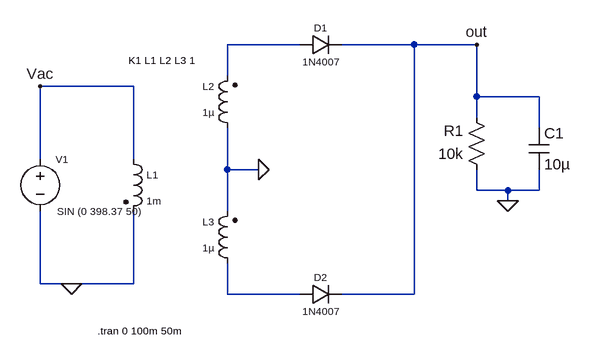
[diagram p0: schematic center-tapped-without-capacitor.asc]
center-tapped-without-capacitor.asc, the LTspice schematic file:
Version 4.1
SHEET 1 888 680
WIRE 464 -48 352 -48
WIRE 640 -48 528 -48
WIRE 736 -48 640 -48
WIRE 352 0 352 -48
WIRE 208 16 64 16
WIRE 736 32 736 -48
WIRE 832 32 736 32
WIRE 736 64 736 32
WIRE 832 80 832 32
WIRE 64 128 64 16
WIRE 208 128 208 16
WIRE 352 144 352 80
WIRE 400 144 352 144
WIRE 736 176 736 144
WIRE 784 176 736 176
WIRE 832 176 832 144
WIRE 832 176 784 176
WIRE 784 192 784 176
WIRE 352 208 352 144
WIRE 64 320 64 208
WIRE 112 320 64 320
WIRE 208 320 208 208
WIRE 208 320 112 320
WIRE 352 336 352 288
WIRE 464 336 352 336
WIRE 640 336 640 -48
WIRE 640 336 528 336
FLAG 112 320 0
FLAG 400 144 0
FLAG 64 16 Vac
FLAG 736 -48 out
FLAG 784 192 0
SYMBOL voltage 64 112 R0
WINDOW 0 24 16 Left 1
WINDOW 3 90 96 Center 1
SYMATTR InstName V1
SYMATTR Value SIN (0 398.37 50)
SYMBOL ind2 192 112 R0
WINDOW 0 36 40 Left 1
WINDOW 3 36 80 Left 1
SYMATTR InstName L1
SYMATTR Value 1m
SYMATTR SpiceLine Rser=1m
SYMBOL ind2 368 96 R180
WINDOW 0 36 80 Left 1
WINDOW 3 36 40 Left 1
SYMATTR InstName L2
SYMATTR Value 1µ
SYMATTR SpiceLine Rser=1m
SYMBOL ind2 368 304 R180
WINDOW 0 36 80 Left 1
WINDOW 3 36 40 Left 1
SYMATTR InstName L3
SYMATTR Value 1µ
SYMATTR SpiceLine Rser=1m
SYMBOL diode 464 -32 R270
WINDOW 0 32 32 VTop 1
WINDOW 3 0 32 VBottom 1
SYMATTR InstName D1
SYMATTR Value 1N4007
SYMBOL diode 464 352 R270
WINDOW 0 32 32 VTop 1
WINDOW 3 0 32 VBottom 1
SYMATTR InstName D2
SYMATTR Value 1N4007
SYMBOL res 752 160 R180
WINDOW 0 36 76 Left 2
WINDOW 3 36 40 Left 2
SYMATTR InstName R1
SYMATTR Value 10k
SYMBOL cap 816 80 R0
SYMATTR InstName C1
SYMATTR Value 10µ
TEXT 200 -24 Left 1 !K1 L1 L2 L3 1
TEXT 152 392 Left 1 !.tran 0 100m 50m

The netlist it stands for:
* center-tapped-without-capacitor.asc
V1 Vac 0 SIN (0 398.37 50)
L1 Vac 0 1m Rser=1m
L2 0 N001 1µ Rser=1m
L3 N002 0 1µ Rser=1m
D1 N001 out 1N4007
D2 N002 out 1N4007
R1 0 out 10k
C1 out 0 10µ
.model D D
.lib standard.dio
K1 L1 L2 L3 1
.tran 0 100m 50m
.backanno
.end